# EAGLE design RetroTime (EAGLE 5.11)
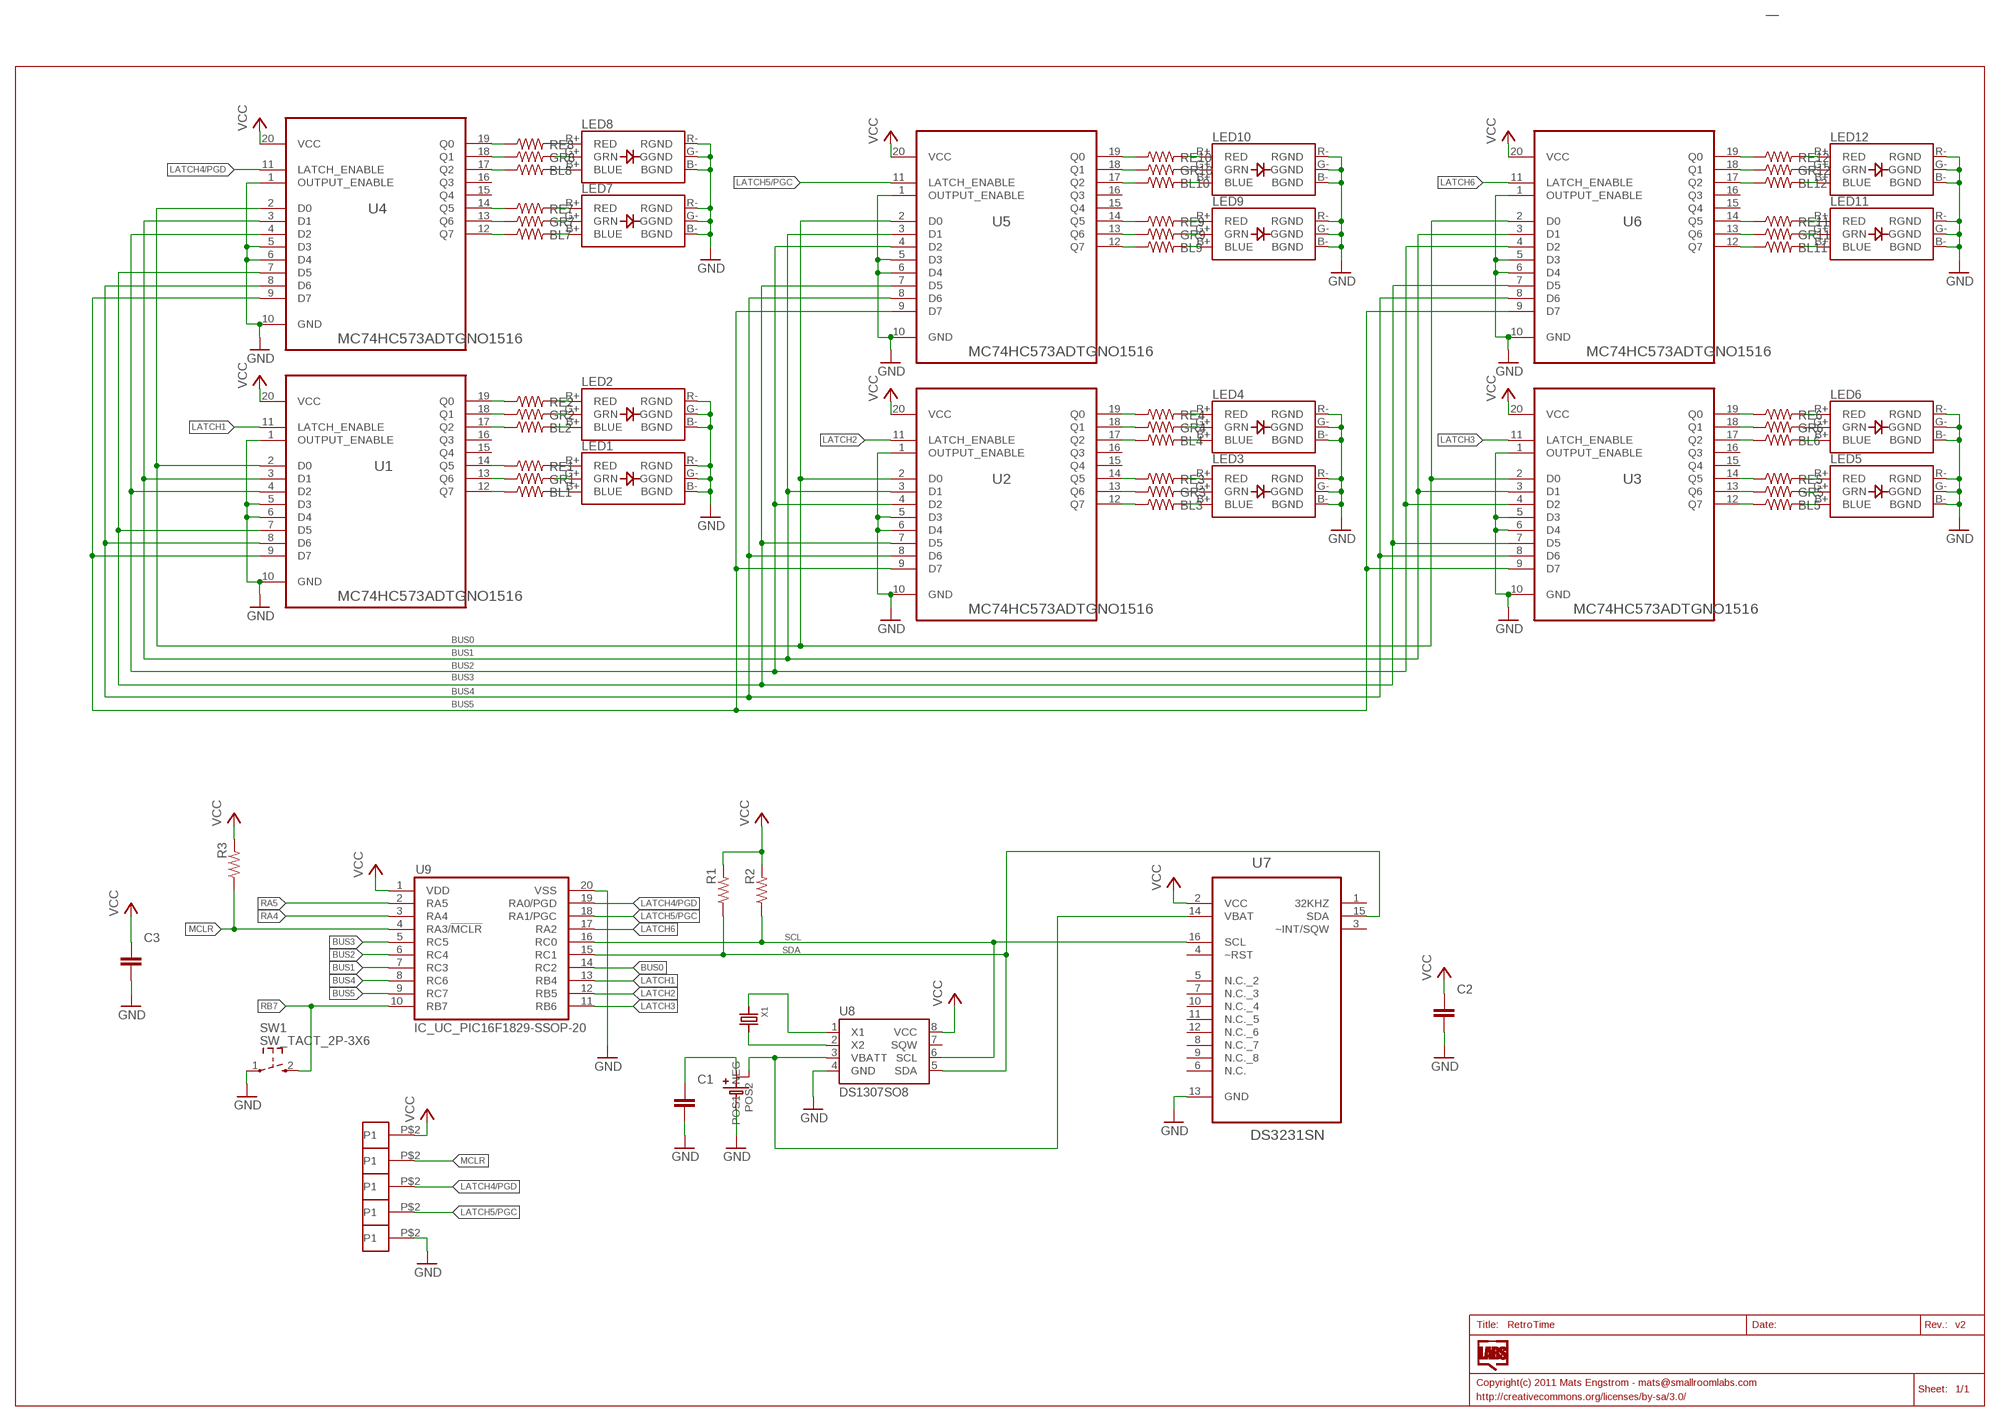
[diagram p0: schematic, sheet 1]

## Parts
BL1  RES0805A  [R0805A]
BL2  RES0805A  [R0805A]
BL3  RES0805A  [R0805A]
BL4  RES0805A  [R0805A]
BL5  RES0805A  [R0805A]
BL6  RES0805A  [R0805A]
BL7  RES0805A  [R0805A]
BL8  RES0805A  [R0805A]
BL9  RES0805A  [R0805A]
BL10  RES0805A  [R0805A]
BL11  RES0805A  [R0805A]
BL12  RES0805A  [R0805A]
C1  CAPACITOR_NPOL-0805  [C805]
C2  CAPACITOR_NPOL-0805  [C805]
C3  CAPACITOR_NPOL-0805  [C805]
GR1  RES0805A  [R0805A]
GR2  RES0805A  [R0805A]
GR3  RES0805A  [R0805A]
GR4  RES0805A  [R0805A]
GR5  RES0805A  [R0805A]
GR6  RES0805A  [R0805A]
GR7  RES0805A  [R0805A]
GR8  RES0805A  [R0805A]
GR9  RES0805A  [R0805A]
GR10  RES0805A  [R0805A]
GR11  RES0805A  [R0805A]
GR12  RES0805A  [R0805A]
LED1  LED-RGB-6PIN-PLCC6  [RGB-PLCC6]
LED2  LED-RGB-6PIN-PLCC6  [RGB-PLCC6]
LED3  LED-RGB-6PIN-PLCC6  [RGB-PLCC6]
LED4  LED-RGB-6PIN-PLCC6  [RGB-PLCC6]
LED5  LED-RGB-6PIN-PLCC6  [RGB-PLCC6]
LED6  LED-RGB-6PIN-PLCC6  [RGB-PLCC6]
LED7  LED-RGB-6PIN-PLCC6  [RGB-PLCC6]
LED8  LED-RGB-6PIN-PLCC6  [RGB-PLCC6]
LED9  LED-RGB-6PIN-PLCC6  [RGB-PLCC6]
LED10  LED-RGB-6PIN-PLCC6  [RGB-PLCC6]
LED11  LED-RGB-6PIN-PLCC6  [RGB-PLCC6]
LED12  LED-RGB-6PIN-PLCC6  [RGB-PLCC6]
P1  PAD-2X3  [PAD2X3]
P2  PAD-2X3  [PAD2X3]
P3  PAD-2X3  [PAD2X3]
P4  PAD-2X3  [PAD2X3]
P5  PAD-2X3  [PAD2X3]
R1  RES0805A  [R0805A]
R2  RES0805A  [R0805A]
R3  RES0805A  [R0805A]
RE1  RES0805A  [R0805A]
RE2  RES0805A  [R0805A]
RE3  RES0805A  [R0805A]
RE4  RES0805A  [R0805A]
RE5  RES0805A  [R0805A]
RE6  RES0805A  [R0805A]
RE7  RES0805A  [R0805A]
RE8  RES0805A  [R0805A]
RE9  RES0805A  [R0805A]
RE10  RES0805A  [R0805A]
RE11  RES0805A  [R0805A]
RE12  RES0805A  [R0805A]
SW1  SW_TACT_2P-3X6  [SW_TACT_3X6]
U1  MC74HC573ADTGNO1516  [SOP65P640X120-20N-NOPIN15/16]
U2  MC74HC573ADTGNO1516  [SOP65P640X120-20N-NOPIN15/16]
U3  MC74HC573ADTGNO1516  [SOP65P640X120-20N-NOPIN15/16]
U4  MC74HC573ADTGNO1516  [SOP65P640X120-20N-NOPIN15/16]
U5  MC74HC573ADTGNO1516  [SOP65P640X120-20N-NOPIN15/16]
U6  MC74HC573ADTGNO1516  [SOP65P640X120-20N-NOPIN15/16]
U7  DS3231SN  [SOIC127P1032X265-16N]
U8  DS1307SO8  [SO08]
U9  IC_UC_PIC16F1829-SSOP-20  [SSOP-20]
U$3  BATTERYCOIN-12MM-SMD  [CR1220-SMD]
X1  CRYSTAL32.768  [CRYSTAL32SMT]

## Nets
BUS0: U1.2(D0) U2.2(D0) U3.2(D0) U4.2(D0) U5.2(D0) U6.2(D0) U9.14(RC2)
BUS1: U1.3(D1) U2.3(D1) U3.3(D1) U4.3(D1) U5.3(D1) U6.3(D1) U9.7(RC3)
BUS2: U1.4(D2) U2.4(D2) U3.4(D2) U4.4(D2) U5.4(D2) U6.4(D2) U9.6(RC4)
BUS3: U1.7(D5) U2.7(D5) U3.7(D5) U4.7(D5) U5.7(D5) U6.7(D5) U9.5(RC5)
BUS4: U1.8(D6) U2.8(D6) U3.8(D6) U4.8(D6) U5.8(D6) U6.8(D6) U9.8(RC6)
BUS5: U1.9(D7) U2.9(D7) U3.9(D7) U4.9(D7) U5.9(D7) U6.9(D7) U9.9(RC7)
GND: C1.2 C2.2 C3.2 LED1.B-(BGND) LED1.G-(GGND) LED1.R-(RGND) LED2.B-(BGND) LED2.G-(GGND) LED2.R-(RGND) LED3.B-(BGND) LED3.G-(GGND) LED3.R-(RGND) LED4.B-(BGND) LED4.G-(GGND) LED4.R-(RGND) LED5.B-(BGND) LED5.G-(GGND) LED5.R-(RGND) LED6.B-(BGND) LED6.G-(GGND) LED6.R-(RGND) LED7.B-(BGND) LED7.G-(GGND) LED7.R-(RGND) LED8.B-(BGND) LED8.G-(GGND) LED8.R-(RGND) LED9.B-(BGND) LED9.G-(GGND) LED9.R-(RGND) LED10.B-(BGND) LED10.G-(GGND) LED10.R-(RGND) LED11.B-(BGND) LED11.G-(GGND) LED11.R-(RGND) LED12.B-(BGND) LED12.G-(GGND) LED12.R-(RGND) P5.P$2(P1) SW1.1 U1.1(OUTPUT_ENABLE) U1.5(D3) U1.6(D4) U1.10(GND) U2.1(OUTPUT_ENABLE) U2.5(D3) U2.6(D4) U2.10(GND) U3.1(OUTPUT_ENABLE) U3.5(D3) U3.6(D4) U3.10(GND) U4.1(OUTPUT_ENABLE) U4.5(D3) U4.6(D4) U4.10(GND) U5.1(OUTPUT_ENABLE) U5.5(D3) U5.6(D4) U5.10(GND) U6.1(OUTPUT_ENABLE) U6.5(D3) U6.6(D4) U6.10(GND) U7.13(GND) U8.4(GND) U9.20(VSS) U$3.-(NEG)
LATCH1: U1.11(LATCH_ENABLE) U9.13(RB4)
LATCH2: U2.11(LATCH_ENABLE) U9.12(RB5)
LATCH3: U3.11(LATCH_ENABLE) U9.11(RB6)
LATCH4/PGD: P3.P$2(P1) U4.11(LATCH_ENABLE) U9.19(RA0/PGD)
LATCH5/PGC: P4.P$2(P1) U5.11(LATCH_ENABLE) U9.18(RA1/PGC)
LATCH6: U6.11(LATCH_ENABLE) U9.17(RA2)
MCLR: P2.P$2(P1) R3.1 U9.4(RA3/!MCLR)
N$1: U8.2(X2) X1.2
N$2: U8.1(X1) X1.1
N$3: RE1.1 U1.14(Q5)
N$4: GR1.1 U1.13(Q6)
N$5: U7.14(VBAT) U8.3(VBATT) U$3.+$2(POS2)
N$6: BL1.1 U1.12(Q7)
N$7: RE2.1 U1.19(Q0)
N$8: GR2.1 U1.18(Q1)
N$9: BL2.1 U1.17(Q2)
N$10: LED2.R+(RED) RE2.2
N$11: GR2.2 LED2.G+(GRN)
N$12: BL2.2 LED2.B+(BLUE)
N$13: LED1.R+(RED) RE1.2
N$14: GR1.2 LED1.G+(GRN)
N$15: BL1.2 LED1.B+(BLUE)
N$16: LED4.R+(RED) RE4.2
N$17: RE3.1 U2.14(Q5)
N$18: GR3.1 U2.13(Q6)
N$19: BL3.1 U2.12(Q7)
N$20: RE4.1 U2.19(Q0)
N$21: GR4.1 U2.18(Q1)
N$22: BL4.1 U2.17(Q2)
N$23: GR4.2 LED4.G+(GRN)
N$24: BL4.2 LED4.B+(BLUE)
N$25: LED3.R+(RED) RE3.2
N$26: GR3.2 LED3.G+(GRN)
N$27: BL3.2 LED3.B+(BLUE)
N$28: RE5.1 U3.14(Q5)
N$29: GR5.1 U3.13(Q6)
N$30: BL5.1 U3.12(Q7)
N$31: RE6.1 U3.19(Q0)
N$32: GR6.1 U3.18(Q1)
N$33: BL6.1 U3.17(Q2)
N$34: LED5.R+(RED) RE5.2
N$35: GR5.2 LED5.G+(GRN)
N$36: BL5.2 LED5.B+(BLUE)
N$37: LED6.R+(RED) RE6.2
N$38: GR6.2 LED6.G+(GRN)
N$39: BL6.2 LED6.B+(BLUE)
N$40: LED7.R+(RED) RE7.2
N$41: GR7.2 LED7.G+(GRN)
N$42: BL7.2 LED7.B+(BLUE)
N$43: LED8.R+(RED) RE8.2
N$44: GR8.2 LED8.G+(GRN)
N$45: BL8.2 LED8.B+(BLUE)
N$46: RE7.1 U4.14(Q5)
N$47: GR7.1 U4.13(Q6)
N$48: BL7.1 U4.12(Q7)
N$49: RE8.1 U4.19(Q0)
N$50: GR8.1 U4.18(Q1)
N$51: BL8.1 U4.17(Q2)
N$52: LED9.R+(RED) RE9.2
N$53: GR9.2 LED9.G+(GRN)
N$54: BL9.2 LED9.B+(BLUE)
N$55: LED10.R+(RED) RE10.2
N$56: GR10.2 LED10.G+(GRN)
N$57: BL10.2 LED10.B+(BLUE)
N$58: RE9.1 U5.14(Q5)
N$59: GR9.1 U5.13(Q6)
N$60: BL9.1 U5.12(Q7)
N$61: RE10.1 U5.19(Q0)
N$62: GR10.1 U5.18(Q1)
N$63: BL10.1 U5.17(Q2)
N$64: RE11.1 U6.14(Q5)
N$65: GR11.1 U6.13(Q6)
N$66: BL11.1 U6.12(Q7)
N$67: RE12.1 U6.19(Q0)
N$68: GR12.1 U6.18(Q1)
N$69: BL12.1 U6.17(Q2)
N$70: LED12.R+(RED) RE12.2
N$71: GR12.2 LED12.G+(GRN)
N$72: BL12.2 LED12.B+(BLUE)
N$73: LED11.R+(RED) RE11.2
N$74: GR11.2 LED11.G+(GRN)
N$75: BL11.2 LED11.B+(BLUE)
N$76: C1.1 U$3.+$1(POS1)
RA4: U9.3(RA4)
RA5: U9.2(RA5)
RB7: SW1.2 U9.10(RB7)
SCL: R2.1 U7.16(SCL) U8.6(SCL) U9.16(RC0)
SDA: R1.1 U7.15(SDA) U8.5(SDA) U9.15(RC1)
VCC: C2.1 C3.1 P1.P$2(P1) R1.2 R2.2 R3.2 U1.20(VCC) U2.20(VCC) U3.20(VCC) U4.20(VCC) U5.20(VCC) U6.20(VCC) U7.2(VCC) U8.8(VCC) U9.1(VDD)
Unconnected: U1.15(Q4) U1.16(Q3) U2.15(Q4) U2.16(Q3) U3.15(Q4) U3.16(Q3) U4.15(Q4) U4.16(Q3) U5.15(Q4) U5.16(Q3) U6.15(Q4) U6.16(Q3) U7.1(32KHZ) U7.3(~INT/SQW) U7.4(~RST) U7.5(N.C._2) U7.6(N.C.) U7.7(N.C._3) U7.8(N.C._7) U7.9(N.C._8) U7.10(N.C._4) U7.11(N.C._5) U7.12(N.C._6) U8.7(SQW)

## Library data of the parts
BL1-BL12 GR1-GR12 R1-R3 RE1-RE12 = SmallRoomLabs:RES
C1-C3 = dp_devices:CAPACITOR_NPOL: Non-Polarized capacitor in various packages
LED1-LED12 = SmallRoomLabs:LED-RGB-6PIN
P1-P5 = SmallRoomLabs:PAD
SW1 = dp_devices:SW_TACT_2P
U1-U6 = SmallRoomLabs:MC74HC573ADTG: Octal Noninverting Latch
U7 = SmallRoomLabs:DS3231SN: Extremely Accurate I2C-Integrated RTC/TCXO/Crystal; MPN: DS3231SN#; OC_FARNELL: 1593292; OC_NEWARK: 68K3406; PACKAGE: SOIC-16; SUPPLIER: Maxim
U8 = SparkFun:DS1307
U9 = dp_devices:IC_UC_PIC16F1829
U$3 = SmallRoomLabs:BATTERY: A23 Farnell/E14 908721
X1 = microbuilder:CRYSTAL: Crystals HC49UP - Surface Mount Crystal 4.0MHz 18pF +/-30ppm Surface Mount Crystal [Digikey: 535-9857-1-ND] 12.0 MHz Surface Mount Crystal [Digikey: 535-9869-6-ND] 25.0 MHz Surface Mount Crystal [Digikey: 535-9078-1-ND] 3.2 x 2.5mm - MEMs SMT Crystal 12.0 MHz 8pF 15ppm 3.2 x 2.5mm Crystal [Digikey: 644-1047-1-ND] 16.0 MHz 8pF 15ppm 3.2 x 2.5mm Crystal [Digikey: 644-1049-1-ND] 16.0 MHz 10pF 10ppm 3.2 x 2.5mm Crystal [Digikey: 644-1100-1-ND] 27.12 MHz 18pF 30ppm 3.2 x 2.5mm Crystal [Digikey: 887-1424-1-ND] 4.9 x 1.8mm - MEMs SMT Crystal 32.768 KHz 12.5pF 20ppm 4.9 x 1.8mm Crystal [Digikey: SE2415CT-ND] Cylinder 32.768KHz Cylinder Crystal

## Board
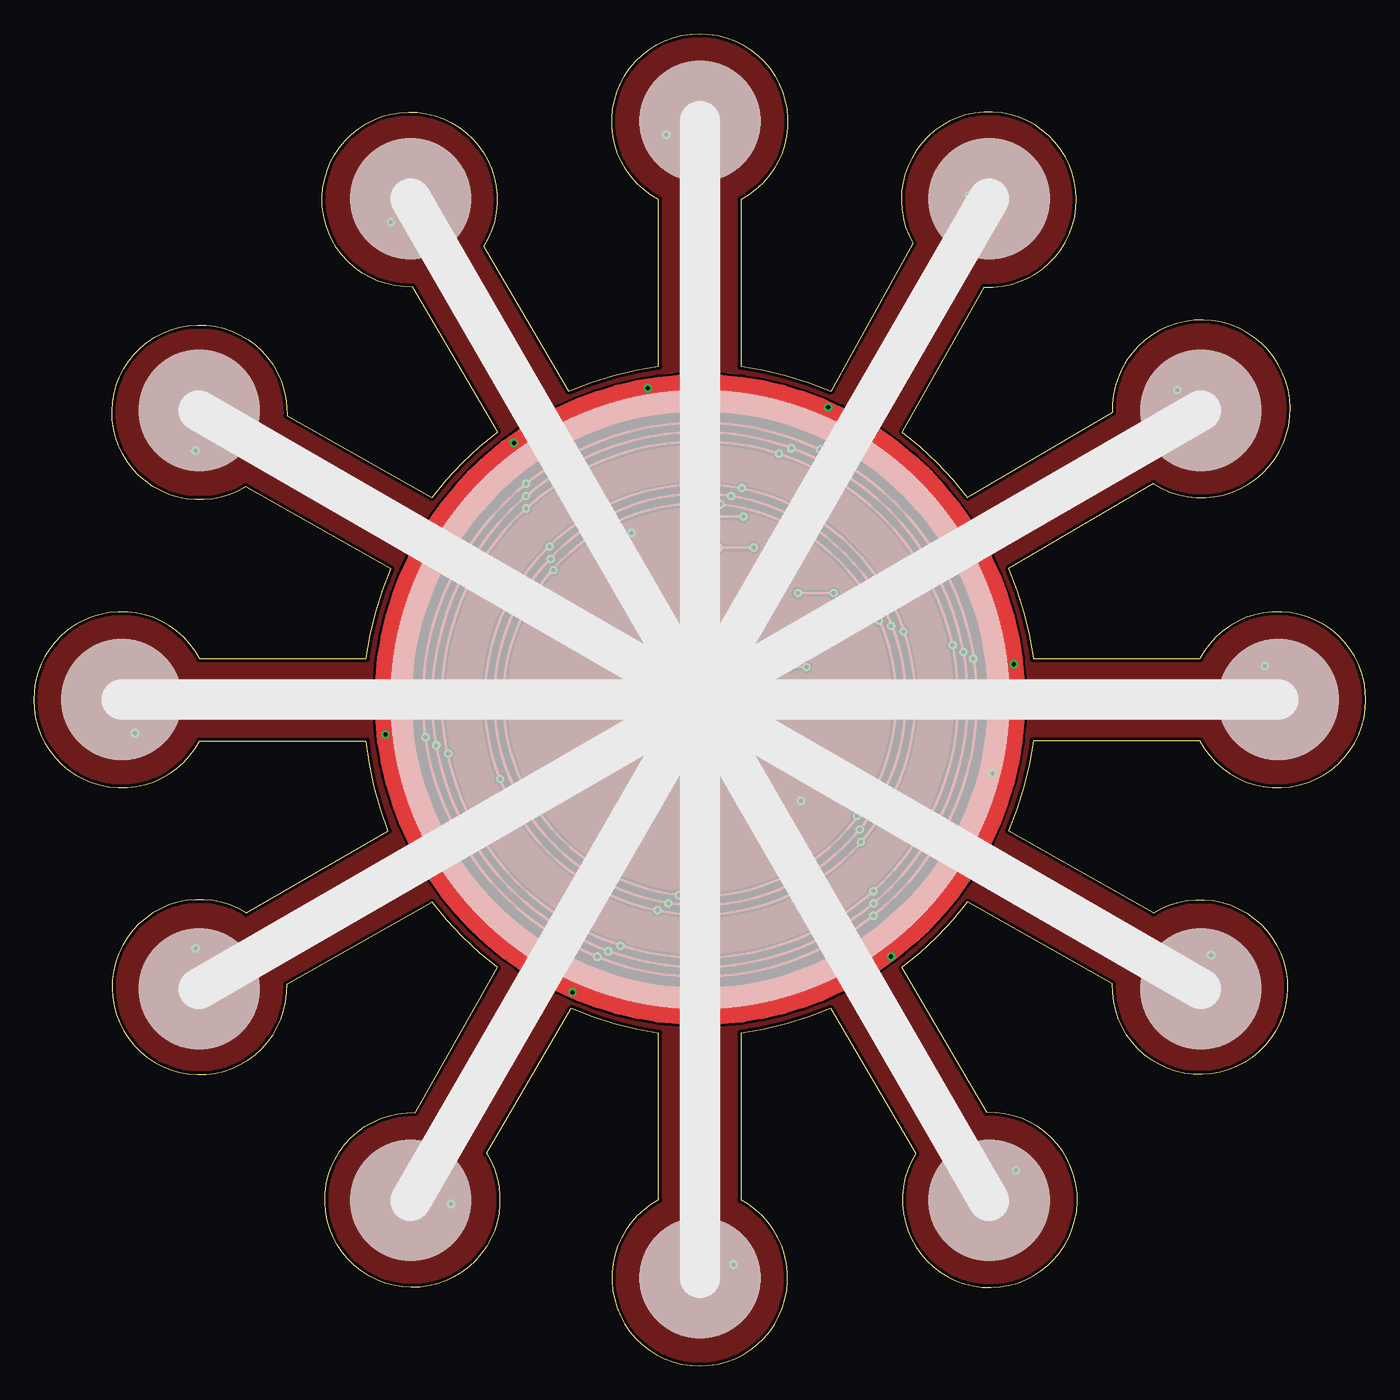
[diagram p1: board, top side]
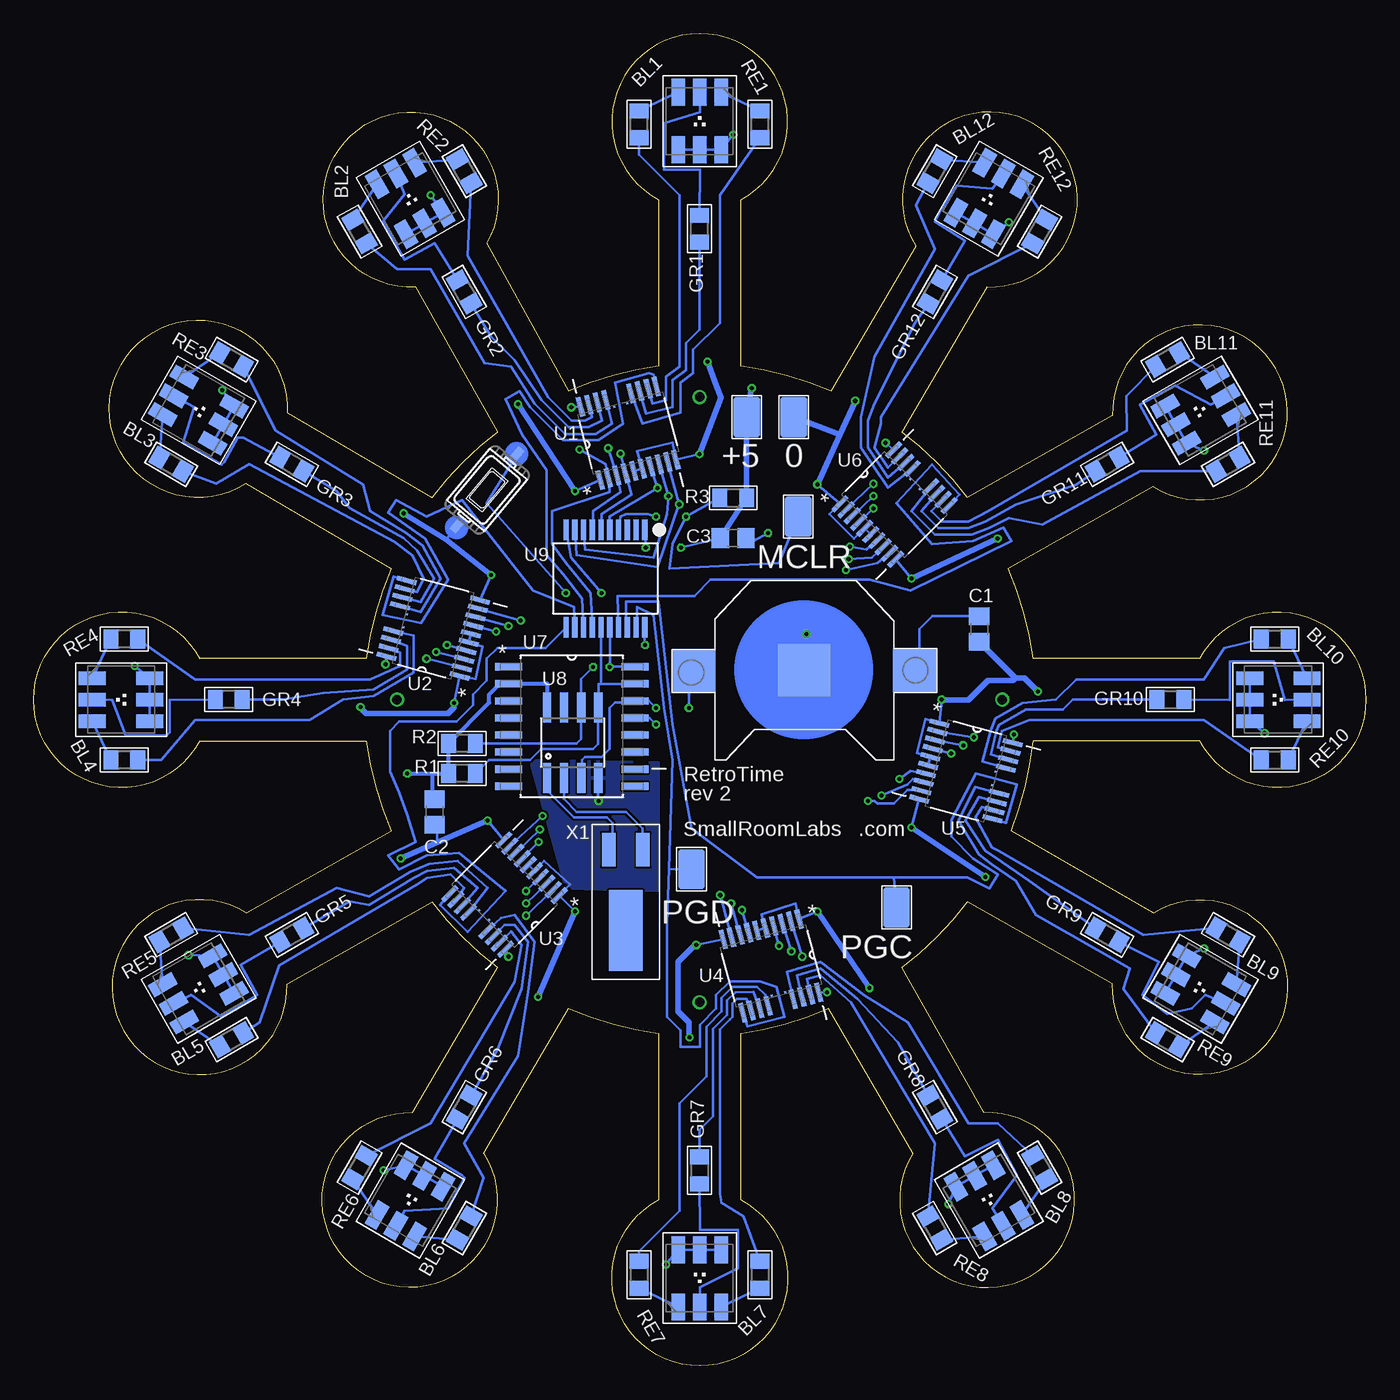
[diagram p2: board, bottom side, seen from below]

Size 99.04 x 99.04 mm. Coordinates in mm from the lower left corner, seen from the top.
Outline: 46.47,86.71 arc-304 52.57,86.71 52.57,74.31 arc-16 59.27,72.48 65.37,83.46 arc-303 70.65,80.2 64.56,69.43 arc-16 69.43,64.56 80.2,70.86 arc-305 83.25,65.57 72.48,59.27 arc-16 74.31,52.57 86.71,52.57 arc-304 86.71,46.47 74.31,46.47 arc-16 72.48,39.77 83.25,33.67 arc-304 80.2,28.39 69.43,34.48 arc-16 64.56,29.61 70.86,18.84 arc-304 65.57,15.79 59.27,26.56 arc-16 52.57,24.73 52.57,12.34 arc-304 46.47,12.34 46.47,24.73 arc-16 39.97,26.56 33.67,15.79 arc-304 28.39,18.84 34.48,29.61 arc-16 29.61,34.48 18.84,28.39 arc-304 15.79,33.67 26.36,39.77 arc-15 24.73,46.47 12.34,46.47 arc-304 12.34,52.57 24.73,52.57 arc-16 26.56,59.27 15.79,65.37 arc-304 18.84,70.65 29.61,64.56 arc-16 34.48,69.43 28.18,80.2 arc-304 33.47,83.25 39.77,72.48 arc-16 46.47,74.31 46.47,86.71
Copper layers (1*16): Top 0.035mm / dielectric 1.5mm / Bottom 0.035mm
Design rules "Fusion_eagle_rule_v1.1": minimum track width 6mil, minimum drill 12mil, track to track 6mil, track to pad 6mil, pad to pad 6mil, via to via 6mil, smd to smd 0mil, copper to edge 10mil, drill to drill 10mil, minimum pad ring 10mil, minimum via ring 6mil, stop-mask expansion 2mil, vias tented up to drill 100mil, thermal gap 10mil

### Footprints (pad centres in the part's own frame; a part is rotated, then mirrored left to right if it is on the bottom)
R0805A = smd 1.1 x 1.4: 1 -1,0; 2 1,0
C805 = smd 1.3 x 1.5: 1 -0.95,0; 2 0.95,0
RGB-PLCC6 = smd 1 x 2: B+ 1.6,-2.158; B- 1.6,2.108; G+ 0,-2.158; G- 0,2.108; R+ -1.6,-2.158; R- -1.6,2.108
PAD2X3 = smd 2 x 3: P$2 0,0
SW_TACT_3X6 = smd 1 x 0.6: 1 -3.5,0; 2 3.5,0
SOP65P640X120-20N-NOPIN15/16 = smd 1.473 x 0.356: 1 -2.819,2.921; 2 -2.819,2.286; 3 -2.819,1.626; 4 -2.819,0.965; 5 -2.819,0.33; 6 -2.819,-0.33; 7 -2.819,-0.965; 8 -2.819,-1.626; 9 -2.819,-2.286; 10 -2.819,-2.921; 11 2.819,-2.921; 12 2.819,-2.286; 13 2.819,-1.626; 14 2.819,-0.965; 17 2.819,0.965; 18 2.819,1.626; 19 2.819,2.286; 20 2.819,2.921 | smd 0.152 x 0.152: 15 2.159,-0.508; 16 2.159,0.508
SOIC127P1032X265-16N = smd 1.981 x 0.533: 1 -4.699,4.445; 2 -4.699,3.175; 3 -4.699,1.905; 4 -4.699,0.635; 5 -4.699,-0.635; 6 -4.699,-1.905; 7 -4.699,-3.175; 8 -4.699,-4.445; 9 4.699,-4.445; 10 4.699,-3.175; 11 4.699,-1.905; 12 4.699,-0.635; 13 4.699,0.635; 14 4.699,1.905; 15 4.699,3.175; 16 4.699,4.445
SO08 = smd 0.61 x 2.21: 1 -1.905,-2.616; 2 -0.635,-2.616; 3 0.635,-2.616; 4 1.905,-2.616; 5 1.905,2.616; 6 0.635,2.616; 7 -0.635,2.616; 8 -1.905,2.616
SSOP-20 = smd 0.4 x 1.5: 1 -2.925,-3.625; 2 -2.275,-3.625; 3 -1.625,-3.625; 4 -0.975,-3.625; 5 -0.325,-3.625; 6 0.325,-3.625; 7 0.975,-3.625; 8 1.625,-3.625; 9 2.275,-3.625; 10 2.925,-3.625; 11 2.925,3.625; 12 2.275,3.625; 13 1.625,3.625; 14 0.975,3.625; 15 0.325,3.625; 16 -0.325,3.625; 17 -0.975,3.625; 18 -1.625,3.625; 19 -2.275,3.625; 20 -2.925,3.625
CR1220-SMD = smd 3.2 x 3.2: +$1 -8.2,0; +$2 8.2,0 | smd 3.9 x 3.9: - 0,0
CRYSTAL32SMT = smd 2.5 x 1: 1 2.125,1.27; 2 2.125,-1.27 | smd 6 x 2.5: CYLINDER -3.875,0

### Placement (x,y rotation side)
BL1  54.03,92.3 90 bottom
BL2  74.81,84.32 120 bottom
BL3  88.82,67.02 150 bottom
BL4  92.3,45.04 180 bottom
BL5  84.32,24.26 210 bottom
BL6  67.02,10.25 240 bottom
BL7  45.04,6.77 270 bottom
BL8  24.26,14.75 300 bottom
BL9  10.25,32.04 330 bottom
BL10  6.77,54.03 0 bottom
BL11  14.75,74.81 30 bottom
BL12  32.04,88.82 60 bottom
C1  28.74,54.78 270 bottom
C2  69.23,41.19 270 bottom
C3  47.03,61.53 0 bottom
GR1  49.53,84.53 90 bottom
GR2  67.03,79.84 120 bottom
GR3  79.84,67.03 150 bottom
GR4  84.53,49.53 180 bottom
GR5  79.84,32.03 210 bottom
GR6  67.03,19.22 240 bottom
GR7  49.53,14.53 270 bottom
GR8  32.03,19.22 300 bottom
GR9  19.22,32.03 330 bottom
GR10  14.53,49.53 0 bottom
GR11  19.22,67.03 30 bottom
GR12  32.03,79.84 60 bottom
LED1  49.53,92.53 180 bottom
LED2  71.03,86.77 210 bottom
LED3  86.77,71.03 240 bottom
LED4  92.53,49.53 270 bottom
LED5  86.77,28.03 300 bottom
LED6  71.03,12.29 330 bottom
LED7  49.53,6.53 0 bottom
LED8  28.03,12.29 30 bottom
LED9  12.29,28.03 60 bottom
LED10  6.53,49.53 90 bottom
LED11  12.29,71.03 120 bottom
LED12  28.03,86.77 150 bottom
P1  46.03,70.53 0 bottom
P2  42.21,63.14 0 bottom
P3  50.13,36.92 0 bottom
P4  34.89,34.08 180 bottom
P5  42.53,70.53 0 bottom
R1  67.2,44.03 180 bottom
R2  67.2,46.27 180 bottom
R3  47.03,64.53 0 bottom
RE1  45.04,92.3 90 bottom
RE2  67.02,88.82 120 bottom
RE3  84.32,74.81 150 bottom
RE4  92.3,54.03 180 bottom
RE5  88.82,32.04 210 bottom
RE6  74.81,14.75 240 bottom
RE7  54.03,6.77 270 bottom
RE8  32.04,10.25 300 bottom
RE9  14.75,24.26 330 bottom
RE10  6.77,45.04 0 bottom
RE11  10.25,67.02 30 bottom
RE12  24.26,84.32 60 bottom
SW1  65.33,65.13 50 bottom
U1  54.84,69.34 105 bottom
U2  69.34,54.84 165 bottom
U3  64.03,35.04 225 bottom
U4  44.23,29.73 285 bottom
U5  29.73,44.23 345 bottom
U6  35.04,64.03 45 bottom
U7  59.03,47.53 0 bottom
U8  58.97,46.33 0 bottom
U9  56.53,58.53 180 bottom
U$3  41.75,51.71 180 bottom
X1  55.02,36.25 90 bottom

### Tracks (layer width: path | path; a pad name or v marks a point on that pad's centre or on a via)
BUS0  (via drill 0.3)
  Top 0.203: 69.9,52.58 69.96,52.22 70.09,50.88 70.13,49.53 70.09,48.19 69.96,46.84 69.74,45.51 69.43,44.2 69.04,42.91 68.57,41.65 68.01,40.42 67.37,39.23 66.66,38.09 65.88,36.99 65.02,35.95 64.1,34.97 63.12,34.05 62.46,33.51 | 69.9,52.58 69.74,53.55 69.43,54.87 69.04,56.16 68.57,57.42 68.01,58.64 67.37,59.83 66.66,60.98 65.88,62.07 65.02,63.12 64.1,64.1 63.12,65.02 62.07,65.88 60.98,66.66 59.83,67.37 58.64,68.01 57.42,68.57 57.17,68.66 | 57.17,68.66 56.16,69.04 54.87,69.43 53.55,69.74 52.22,69.96 50.88,70.09 49.53,70.13 48.19,70.09 46.84,69.96 45.51,69.74 44.2,69.43 42.91,69.04 41.65,68.57 40.42,68.01 39.23,67.37 38.09,66.66 36.99,65.88 36.64,65.58 | 36.64,65.58 35.95,65.02 34.97,64.1 34.05,63.12 33.19,62.07 32.41,60.98 31.69,59.83 31.06,58.64 30.5,57.42 30.03,56.16 29.64,54.87 29.33,53.55 29.11,52.22 28.98,50.88 28.93,49.53 28.98,48.19 29.11,46.84 29.13,46.72 | 29.13,46.72 29.33,45.51 29.64,44.2 30.03,42.91 30.5,41.65 31.06,40.42 31.69,39.23 32.41,38.09 33.19,36.99 34.05,35.95 34.97,34.97 35.95,34.05 36.99,33.19 38.09,32.41 39.23,31.69 40.42,31.06 41.65,30.5 41.8,30.45 | 41.8,30.45 42.91,30.03 44.2,29.64 45.51,29.33 46.84,29.11 48.19,28.98 49.53,28.93 50.88,28.98 52.22,29.11 53.55,29.33 54.87,29.64 56.16,30.03 57.42,30.5 58.64,31.06 59.83,31.69 60.98,32.41 62.07,33.19 62.46,33.51 | 29.13,46.72 v29.13,46.73 | 41.8,30.45 v41.9,30.42 | 62.46,33.51 v62.42,33.47 | 69.9,52.58 v69.84,52.57 | 57.17,68.66 v58.46,68.12 | 36.64,65.58 v36.62,65.57
  Bottom 0.203: v29.13,46.73 U5.2 | v41.9,30.42 U4.2 | v62.42,33.47 U3.2 | v69.84,52.57 U2.2 | v36.62,65.57 U6.2 | U9.14 57.65,57.45 59.48,59.68 60.49,61.1 60.49,63.54 56.23,64.96 U1.2 56.53,67.03 v58.46,68.12
BUS1  (via drill 0.3)
  Top 0.203: 69.11,53.09 69.26,52.13 69.39,50.84 69.43,49.53 69.39,48.23 69.26,46.94 69.05,45.65 68.76,44.38 68.38,43.14 67.92,41.92 67.38,40.73 66.77,39.58 66.08,38.48 65.32,37.42 64.5,36.41 63.6,35.46 62.65,34.57 62.52,34.46 | 69.11,53.09 69.05,53.42 68.76,54.68 68.38,55.93 67.92,57.15 67.38,58.34 66.77,59.48 66.08,60.59 65.32,61.65 64.5,62.65 63.6,63.6 62.65,64.5 61.65,65.32 60.59,66.08 59.48,66.77 58.34,67.38 57.15,67.92 56.34,68.22 | 56.34,68.22 55.93,68.38 54.68,68.76 53.42,69.05 52.13,69.26 50.84,69.39 49.53,69.43 48.23,69.39 46.94,69.26 45.65,69.05 44.38,68.76 43.14,68.38 41.92,67.92 40.73,67.38 39.58,66.77 38.48,66.08 37.42,65.32 36.63,64.68 | 36.63,64.68 36.41,64.5 35.46,63.6 34.57,62.65 33.75,61.65 32.99,60.59 32.3,59.48 31.69,58.34 31.15,57.15 30.69,55.93 30.31,54.68 30.02,53.42 29.8,52.13 29.68,50.84 29.63,49.53 29.68,48.23 29.8,46.94 29.93,46.15 | 29.93,46.15 30.02,45.65 30.31,44.38 30.69,43.14 31.15,41.92 31.69,40.73 32.3,39.58 32.99,38.48 33.75,37.42 34.57,36.41 35.46,35.46 36.41,34.57 37.42,33.75 38.48,32.99 39.58,32.3 40.73,31.69 41.92,31.15 42.8,30.82 | 42.8,30.82 43.14,30.69 44.38,30.31 45.65,30.02 46.94,29.8 48.23,29.68 49.53,29.63 50.84,29.68 52.13,29.8 53.42,30.02 54.68,30.31 55.93,30.69 57.15,31.15 58.34,31.69 59.48,32.3 60.59,32.99 61.65,33.75 62.52,34.46 | 29.93,46.15 v29.93,46.13 | 42.8,30.82 v42.71,30.83 | 62.52,34.46 v62.42,34.38 | 69.11,53.09 v69.13,53.08 | 56.34,68.22 v56.33,68.22 | 36.63,64.68 v36.62,64.66
  Bottom 0.203: v29.93,46.13 U5.3 | v42.71,30.83 U4.3 | v62.42,34.38 U3.3 | v69.13,53.08 U2.3 | v56.33,68.22 U1.3 55.41,64.96 57.45,63.54 U9.7 | v36.62,64.66 U6.3
BUS2  (via drill 0.3)
  Top 0.203: 68.3,53.56 68.36,53.28 68.57,52.04 68.69,50.79 68.73,49.53 68.69,48.28 68.57,47.03 68.36,45.79 68.08,44.56 67.71,43.36 67.27,42.19 66.75,41.04 66.16,39.93 65.5,38.87 64.77,37.85 63.97,36.87 63.11,35.96 62.48,35.37 | 68.3,53.56 68.08,54.5 67.71,55.71 67.27,56.88 66.75,58.03 66.16,59.13 65.5,60.2 64.77,61.22 63.97,62.19 63.11,63.11 62.19,63.97 61.22,64.77 60.2,65.5 59.13,66.16 58.03,66.75 56.88,67.27 55.71,67.71 55.46,67.79 | 55.46,67.79 54.5,68.08 53.28,68.36 52.04,68.57 50.79,68.69 49.53,68.73 48.28,68.69 47.03,68.57 45.79,68.36 44.56,68.08 43.36,67.71 42.19,67.27 41.04,66.75 39.93,66.16 38.87,65.5 37.85,64.77 36.87,63.97 36.67,63.77 | 36.67,63.77 35.96,63.11 35.1,62.19 34.3,61.22 33.57,60.2 32.91,59.13 32.31,58.03 31.8,56.88 31.35,55.71 30.99,54.5 30.7,53.28 30.5,52.04 30.37,50.79 30.33,49.53 30.37,48.28 30.5,47.03 30.7,45.79 30.76,45.56 | 30.76,45.56 30.99,44.56 31.35,43.36 31.8,42.19 32.31,41.04 32.91,39.93 33.57,38.87 34.3,37.85 35.1,36.87 35.96,35.96 36.87,35.1 37.85,34.3 38.87,33.57 39.93,32.91 41.04,32.31 42.19,31.8 43.36,31.35 43.59,31.28 | 43.59,31.28 44.56,30.99 45.79,30.7 47.03,30.5 48.28,30.37 49.53,30.33 50.79,30.37 52.04,30.5 53.28,30.7 54.5,30.99 55.71,31.35 56.88,31.8 58.03,32.31 59.13,32.91 60.2,33.57 61.22,34.3 62.19,35.1 62.48,35.37 | 30.76,45.56 v30.83,45.53 | 43.59,31.28 v43.63,31.23 | 62.48,35.37 v62.42,35.3 | 68.3,53.56 v68.32,53.58 | 55.46,67.79 v55.41,67.81 | 36.67,63.77 v36.62,63.74
  Bottom 0.203: v30.83,45.53 U5.4 | v43.63,31.23 U4.4 | v62.42,35.3 U3.4 | v68.32,53.58 U2.4 | v55.41,67.81 U1.4 54.6,64.76 56.84,63.34 U9.6 | v36.62,63.74 U6.4
BUS3  (via drill 0.3)
  Top 0.203: 64.68,54.68 64.99,53.67 65.23,52.65 65.4,51.62 65.5,50.58 65.53,49.53 65.5,48.49 65.4,47.45 65.23,46.41 64.99,45.39 64.68,44.39 64.32,43.41 63.88,42.46 63.39,41.53 62.84,40.64 62.23,39.79 61.56,38.98 | 64.68,54.68 64.32,55.66 63.88,56.61 63.39,57.53 62.84,58.42 62.23,59.27 61.56,60.08 60.85,60.85 60.08,61.56 59.27,62.23 58.42,62.84 57.53,63.39 56.61,63.88 55.66,64.32 54.68,64.68 53.67,64.99 52.65,65.23 | 52.65,65.23 51.62,65.4 50.58,65.5 49.53,65.53 48.49,65.5 47.45,65.4 46.41,65.23 45.39,64.99 44.39,64.68 43.41,64.32 42.46,63.88 41.53,63.39 40.64,62.84 39.79,62.23 38.98,61.56 38.22,60.85 37.61,60.19 | 37.61,60.19 37.5,60.08 36.84,59.27 36.23,58.42 35.68,57.53 35.18,56.61 34.75,55.66 34.38,54.68 34.08,53.67 33.84,52.65 33.67,51.62 33.57,50.58 33.53,49.53 33.57,48.49 33.67,47.45 33.84,46.41 34.08,45.39 34.35,44.48 | 34.35,44.48 34.38,44.39 34.75,43.41 35.18,42.46 35.68,41.53 36.23,40.64 36.84,39.79 37.5,38.98 38.22,38.22 38.98,37.5 39.79,36.84 40.64,36.23 41.53,35.68 42.46,35.18 43.41,34.75 44.39,34.38 45.39,34.08 46.41,33.84 | 46.41,33.84 47.45,33.67 48.49,33.57 49.53,33.53 50.58,33.57 51.62,33.67 52.65,33.84 53.67,34.08 54.68,34.38 55.66,34.75 56.61,35.18 57.53,35.68 58.42,36.23 59.27,36.84 60.08,37.5 60.85,38.22 61.56,38.98 | 34.35,44.48 v34.69,43.63 | 37.61,60.19 v38.34,60.9 | 52.65,65.23 v52.67,65.27 | 64.68,54.68 v64.66,54.6 | 61.56,38.98 v61.51,38.95 | 46.41,33.84 v46.37,33.87
  Bottom 0.203: U1.7 v52.67,65.27 56.23,63.14 U9.5 | v64.66,54.6 U2.7 | v61.51,38.95 U3.7 | v46.37,33.87 U4.7 | U6.7 37.13,60.7 v38.34,60.9 | U5.7 33.87,44.24 v34.69,43.63
BUS4  (via drill 0.3)
  Top 0.203: 63.81,55.02 64.02,54.45 64.31,53.49 64.54,52.52 64.7,51.53 64.8,50.53 64.83,49.53 64.8,48.53 64.7,47.54 64.54,46.55 64.31,45.57 64.02,44.62 63.67,43.68 63.26,42.77 62.78,41.88 62.25,41.03 61.67,40.22 61.38,39.86 | 63.81,55.02 63.67,55.39 63.26,56.3 62.78,57.18 62.25,58.03 61.67,58.85 61.04,59.62 60.35,60.35 59.62,61.04 58.85,61.67 58.03,62.25 57.18,62.78 56.3,63.26 55.39,63.67 54.45,64.02 53.49,64.31 52.52,64.54 51.74,64.67 | 51.74,64.67 51.53,64.7 50.53,64.8 49.53,64.83 48.53,64.8 47.54,64.7 46.55,64.54 45.57,64.31 44.62,64.02 43.68,63.67 42.77,63.26 41.88,62.78 41.03,62.25 40.22,61.67 39.45,61.04 38.71,60.35 38.03,59.62 37.66,59.18 | 37.66,59.18 37.4,58.85 36.81,58.03 36.28,57.18 35.81,56.3 35.4,55.39 35.05,54.45 34.75,53.49 34.53,52.52 34.36,51.53 34.27,50.53 34.23,49.53 34.27,48.53 34.36,47.54 34.53,46.55 34.75,45.57 35.05,44.62 35.26,44.03 | 35.26,44.03 35.4,43.68 35.81,42.77 36.28,41.88 36.81,41.03 37.4,40.22 38.03,39.45 38.71,38.71 39.45,38.03 40.22,37.4 41.03,36.81 41.88,36.28 42.77,35.81 43.68,35.4 44.62,35.05 45.57,34.75 46.55,34.53 47.31,34.4 | 47.31,34.4 47.54,34.36 48.53,34.27 49.53,34.23 50.53,34.27 51.53,34.36 52.52,34.53 53.49,34.75 54.45,35.05 55.39,35.4 56.3,35.81 57.18,36.28 58.03,36.81 58.85,37.4 59.62,38.03 60.35,38.71 61.04,39.45 61.38,39.86 | 35.26,44.03 v36.01,42.41 | 37.66,59.18 v38.45,59.99 | 51.74,64.67 v51.86,64.66 | 63.81,55.02 v63.74,55.01 | 61.38,39.86 v61.41,39.87 | v47.18,34.38 47.31,34.4
  Bottom 0.203: U1.8 v51.86,64.66 51.96,63.34 52.98,60.09 58.06,60.7 U9.8 | v63.74,55.01 U2.8 | v61.41,39.87 U3.8 | U4.8 v47.18,34.38 | U6.8 36.72,60.09 v38.45,59.99 | U5.8 33.67,43.63 34.08,43.22 v36.01,42.41
BUS5  (via drill 0.3)
  Top 0.203: 62.89,55.42 63.02,55.12 63.36,54.23 63.64,53.31 63.85,52.38 64.01,51.44 64.1,50.49 64.13,49.53 64.1,48.58 64.01,47.63 63.85,46.69 63.64,45.75 63.36,44.84 63.02,43.95 62.63,43.08 62.18,42.23 61.67,41.42 61.17,40.72 | 62.89,55.42 62.63,55.99 62.18,56.83 61.67,57.64 61.12,58.42 60.51,59.16 59.86,59.86 59.16,60.51 58.42,61.12 57.64,61.67 56.83,62.18 55.99,62.63 55.12,63.02 54.23,63.36 53.31,63.64 52.38,63.85 51.44,64.01 50.99,64.05 | 50.99,64.05 50.49,64.1 49.53,64.13 48.58,64.1 47.63,64.01 46.69,63.85 45.75,63.64 44.84,63.36 43.95,63.02 43.08,62.63 42.23,62.18 41.42,61.67 40.65,61.12 39.91,60.51 39.21,59.86 38.56,59.16 37.95,58.42 37.78,58.18 | 37.78,58.18 37.39,57.64 36.89,56.83 36.44,55.99 36.04,55.12 35.71,54.23 35.43,53.31 35.21,52.38 35.06,51.44 34.96,50.49 34.93,49.53 34.96,48.58 35.06,47.63 35.21,46.69 35.43,45.75 35.71,44.84 36.04,43.95 36.2,43.6 | 36.2,43.6 36.44,43.08 36.89,42.23 37.39,41.42 37.95,40.65 38.56,39.91 39.21,39.21 39.91,38.56 40.65,37.95 41.42,37.39 42.23,36.89 43.08,36.44 43.95,36.04 44.84,35.71 45.75,35.43 46.69,35.21 47.63,35.06 48.14,35.01 | 48.14,35.01 48.58,34.96 49.53,34.93 50.49,34.96 51.44,35.06 52.38,35.21 53.31,35.43 54.23,35.71 55.12,36.04 55.99,36.44 56.83,36.89 57.64,37.39 58.42,37.95 59.16,38.56 59.86,39.21 60.51,39.91 61.12,40.65 61.17,40.72 | 36.2,43.6 v37.02,42 | 37.78,58.18 v38.65,59.17 | 50.99,64.05 v51.04,64.05 | 62.89,55.42 v62.83,55.41 | 61.17,40.72 v61.2,40.88 | v48,34.99 48.14,35.01
  Bottom 0.203: U1.9 v51.04,64.05 52.66,59.38 58.66,60.29 U9.9 | v62.83,55.41 U2.9 | v61.2,40.88 U3.9 | U4.9 v48,34.99 | U6.9 36.31,59.68 v38.65,59.17 | v37.02,42 36.52,42 36.31,41.8 35.09,41.8 34.08,42.82 33.06,42.82 U5.9
GND  (via drill 0.3)
  Bottom 0.203: U1.5 U1.6 54.19,68.01 51.55,68.62 U1.10 v49.53,67.78 | U2.6 U2.5 65.68,53.48 66.18,51.04 U2.1 v67.78,49.28 | U3.6 U3.5 61.1,37.53 59.17,35.8 U3.1 v58.78,33.78 | U4.6 U4.5 44.95,33.57 42.41,34.38 U4.1 v40.78,33.78 | U5.6 U5.5 33.37,45.56 32.76,48.1 U5.1 v31.53,49.53 | U6.6 U6.5 38.04,61.51 39.87,63.34 U6.1 v40.78,65.53 | v33.78,58.53 U6.10 | U1.1 v58.78,65.03 | U2.10 v65.03,58.78 | U3.10 v65.28,40.53 | v49.78,31.28 U4.10 | v33.78,40.03 U5.10 | U$3.- 41.75,54.55 v41.6,54.4 | U8.4 57.06,42.03 v57.04,42 | 53.61,55.03 53.61,54.02 v53.58,53.58 | C2.2 69.03,40.24 69.03,38.9 | C3.2 45.52,61.31 v44.44,61.92 | LED12.B- LED12.G- LED12.R- v26.53,85.03 | LED1.B- LED1.G- LED1.R- v47.03,91.53 | LED2.B- LED2.G- LED2.R- v69.53,87.03 | LED3.B- LED3.G- LED3.R- v85.03,72.53 | LED4.B- LED4.G- LED4.R- v91.53,52.03 | LED5.B- LED5.G- LED5.R- v87.53,30.53 | LED7.B- LED7.G- LED7.R- v52.03,7.53 | LED6.B- LED6.G- LED6.R- v73.03,14.53 | LED8.B- LED8.G- LED8.R- v31.03,12.03 | LED9.R- LED9.G- LED9.B- v12.03,31.03 | LED10.B- LED10.G- LED10.R- v7.53,47.03 | LED11.B- LED11.G- LED11.R- v12.03,68.03 | 68.36,61.42 SW1.1 | v52.77,47.69 53.25,48.17 U7.13
  Bottom 0.305: U9.20 53.61,55.03
  Bottom 0.406: v27.38,61.5 v33.78,58.53 | v40.78,65.53 39.1,69.23 | 39.1,69.23 v37.96,71.74 | v58.78,65.03 v63.03,71.49 | v65.03,58.78 68.36,61.42 v71.54,63.38 | v65.28,40.53 69.03,38.9 v71.75,37.72 | v36.9,28.09 v40.78,33.78 | v28.29,36.35 v33.78,40.03 | v61.55,27.42 v58.78,33.78 | v48.95,74.64 48.27,72.83 47.96,71.99 v49.53,67.78 | v24.38,50.14 25.38,51.15 26.06,51.15 | v49.78,31.28 49.88,31.28 51.15,30.01 51.15,26.36 50.33,25.54 50.33,24.53 | v67.78,49.28 67.78,48.94 68.22,48.5 74.31,48.5 74.72,48.91 | 39.1,69.23 P5.P$2 | 26.06,51.15 C1.2 | 31.44,49.52 29.56,49.52 28.11,50.97 26.24,50.97 26.06,51.15
  other vias: 74.75,48.98 50.29,24.42
  pour Top: -0.47,-0.47 -0.47,99.53 99.53,99.53 99.53,-0.47
  pour Top: 33.27,49.52 33.27,36.11 33.27,34.69 65.57,34.69 65.57,63.75 33.27,63.75
  pour Bottom: 52.57,44.85 62.12,45.05 59.48,35.5 52.57,35.3
LATCH1
  Bottom 0.203: U1.11 52.98,73.7 53.28,73.8 55.82,73.09 55.21,70.04 57.04,68.82 59.68,68.82 62.12,71.26 62.93,72.48 63.95,71.87 62.73,69.23 60.9,66.59 60.9,60.29 59.68,58.87 58.26,57.04 U9.13
LATCH2
  Bottom 0.203: U2.11 72.28,58.66 73.09,55.82 70.25,55.21 68.22,58.46 69.94,61.51 72.69,63.44 72.08,64.35 69.84,63.14 67.2,64.35 61.92,57.65 58.87,56.43 U9.12
LATCH3
  Bottom 0.203: U3.11 68.82,34.28 66.79,32.25 63.95,35.3 67.4,38.14 69.84,37.94 71.87,36.92 72.69,37.94 70.65,38.95 71.26,40.99 71.87,42.61 72.56,44.21 72.56,47.21 71.87,47.9 67.61,47.9 66.39,49.11 66.39,49.93 65.37,50.94 65.37,52.57 64.56,53.38 60.99,53.38 U9.11
LATCH4/PGD
  Bottom 0.203: U4.11 45.96,25.24 43.22,25.95 43.83,28.18 45.05,28.59 47.29,28.59 48.3,27.58 48.3,26.56 49.52,25.34 49.52,23.71 50.94,23.71 50.94,24.93 51.96,25.95 51.96,32.86 51.82,36.94 | U9.19 54.19,54.97 54.19,56.43 52.98,55.82 52.16,48.91 51.55,45.05 51.82,36.94 | 51.82,36.94 P3.P$2
LATCH5/PGC
  Bottom 0.203: U5.11 26.76,40.38 25.95,43.22 29,44.03 30.83,40.58 30.83,39.36 29.2,37.74 27.37,36.52 27.98,35.5 29.61,36.31 35.09,36.31 | U9.18 55.01,55.01 55.01,56.84 52.57,56.84 51.55,47.69 50.13,39.97 45.25,36.31 35.09,36.31 | 35.09,36.31 P4.P$2
LATCH6
  Bottom 0.203: U6.11 30.22,64.76 32.25,67 34.89,64.15 32.25,61.1 29.2,61.31 26.97,62.32 26.36,61.31 33.87,57.65 36.92,58.46 48.71,58.46 49.93,57.24 55.62,57.24 U9.17
MCLR  (via drill 0.3)
  Top 0.203: v50.54,63.14 v52.77,63.14
  Bottom 0.203: U9.4 55.41,63.14 55.01,63.34 53.38,63.34 v52.77,63.14 | R3.1 v50.54,63.14 51.55,61.1 51.76,59.27 43.63,59.68 P2.P$2
N$1
  Bottom 0.203: X1.2 53.79,38.41 53.79,39.97 55.01,41.19 58.66,41.19 59.6,42.13 U8.2
N$2
  Bottom 0.203: X1.1 56.02,38.64 56.02,40.38 56.43,40.78 58.87,40.78 60.87,42.79 U8.1
N$3
  Bottom 0.203: U1.14 53.78,70.03 50.94,70.86 50.94,73.09 50.03,73.8 50.03,75.53 48.03,77.53 48.03,87.03 RE1.1
N$4
  Bottom 0.203: U1.13 53.53,70.78 51.53,71.28 51.53,73.28 50.53,74.03 50.53,76.03 49.53,77.03 GR1.1
N$5  (via drill 0.3)
  Top 0.203: v50.33,48.91 v52.77,48.91
  Bottom 0.203: U8.3 58.26,43.79 58.26,45.05 58.06,45.25 56.84,45.25 56.23,45.86 56.23,48.91 55.82,49.32 54.46,49.32 U7.14 53.3,49.44 v52.77,48.91 | v50.33,48.91 50.33,51.32 U$3.+$2
N$6
  Bottom 0.203: U1.12 53.03,71.53 52.03,71.78 52.03,73.53 51.03,74.28 51.03,87.03 54.03,90.03 BL1.1
N$7
  Bottom 0.203: U1.19 57.53,70.53 58.03,70.28 59.03,70.28 60.78,72.03 66.78,82.53 RE2.1
N$8
  Bottom 0.203: U1.18 56.78,70.28 57.78,69.78 59.28,69.78 61.28,71.78 63.28,74.78 65.03,76.53 GR2.1
N$9
  Bottom 0.203: U1.17 56.03,70.03 57.28,69.28 59.53,69.28 61.78,71.53 63.53,74.28 65.53,74.53 69.53,81.53 72.03,81.53 BL2.1
N$10
  Bottom 0.203: RE2.2 LED2.R+
N$11
  Bottom 0.203: GR2.2 69.23,83.46 71.47,82.24 73.09,85.08 71.47,87.11 LED2.G+
N$12
  Bottom 0.203: BL2.2 LED2.B+
N$13
  Bottom 0.203: RE1.2 LED1.R+
N$14
  Bottom 0.203: GR1.2 49.52,88.94 52.16,88.94 52.16,92.4 49.52,93.21 LED1.G+
N$15
  Bottom 0.203: LED1.B+ BL1.2
N$16
  Bottom 0.203: LED4.R+ RE4.2
N$17
  Bottom 0.203: U2.14 70.28,56.03 68.78,58.53 70.14,60.98 71.39,61.93 74.03,63.53 74.53,65.53 81.03,69.53 RE3.1
N$18
  Bottom 0.203: U2.13 70.28,56.78 69.28,58.53 70.53,60.63 71.53,61.53 75.53,63.78 76.53,65.03 GR3.1
N$19
  Bottom 0.203: U2.12 70.53,57.53 70.03,58.53 70.89,60.23 72.26,61.29 83.03,67.03 85.49,65.57 BL3.1
N$20
  Bottom 0.203: U2.19 71.78,53.03 71.78,52.03 74.03,51.03 87.03,51.03 RE4.1
N$21
  Bottom 0.203: U2.18 71.28,53.53 71.28,51.78 73.78,50.28 77.53,50.03 80.53,49.53 GR4.1
N$22
  Bottom 0.203: U2.17 70.78,54.28 70.78,51.53 73.78,49.78 76.03,49.53 78.53,48.03 87.03,48.03 89.55,45.05 BL4.1
N$23
  Bottom 0.203: GR4.2 88.94,49.52 88.94,47.08 89.14,46.88 92.19,46.88 93.21,49.52 LED4.G+
N$24
  Bottom 0.203: BL4.2 LED4.B+
N$25
  Bottom 0.203: RE3.2 LED3.R+
N$26
  Bottom 0.203: GR3.2 83.46,69.03 83.86,69.03 84.88,67.2 85.08,67 87.93,68.62 87.11,71.26 LED3.G+
N$27
  Bottom 0.203: BL3.2 LED3.B+
N$28
  Bottom 0.203: U3.14 65.28,35.53 67.53,37.53 69.64,37.33 71.06,36.72 74.11,34.89 76.53,35.53 83.03,32.03 RE5.1
N$29
  Bottom 0.203: U3.13 66.03,35.53 67.78,37.03 69.78,36.78 70.78,36.28 74.11,34.28 75.53,34.53 GR5.1
N$30
  Bottom 0.203: U3.12 67.03,35.53 68.03,36.53 69.78,36.28 70.53,35.78 80.78,29.78 82.24,25.54 BL5.1
N$31
  Bottom 0.203: U3.19 63.53,32.28 62.78,31.28 63.28,28.53 69.53,18.03 RE6.1
N$32
  Bottom 0.203: U3.18 64.03,32.78 63.28,32.78 62.28,31.53 62.78,28.03 64.53,23.53 GR6.1
N$33
  Bottom 0.203: U3.17 64.28,33.28 63.28,33.53 61.78,31.53 62.28,27.78 63.03,23.03 67.03,16.53 65.57,13.96 BL6.1
N$34
  Bottom 0.203: LED5.R+ RE5.2
N$35
  Bottom 0.203: GR5.2 83.66,29.81 82.44,27.58 85.08,25.95 87.32,27.58 LED5.G+
N$36
  Bottom 0.203: BL5.2 LED5.B+
N$37
  Bottom 0.203: LED6.R+ RE6.2
N$38
  Bottom 0.203: GR6.2 69.23,15.38 67.2,14.16 67,13.96 68.22,11.73 71.47,11.52 LED6.G+
N$39
  Bottom 0.203: BL6.2 LED6.B+
N$40
  Bottom 0.203: LED7.R+ RE7.2
N$41
  Bottom 0.203: GR7.2 49.52,10.1 46.68,10.1 46.68,7.26 49.52,5.83 LED7.G+
N$42
  Bottom 0.203: BL7.2 LED7.B+
N$43
  Bottom 0.203: LED8.R+ RE8.2
N$44
  Bottom 0.203: GR8.2 29.81,15.59 27.37,16.81 25.95,14.16 27.78,11.73 LED8.G+
N$45
  Bottom 0.203: LED8.B+ BL8.2
N$46
  Bottom 0.203: U4.14 44.64,27.58 45.25,28.18 47.08,28.18 47.9,27.37 47.9,26.36 49.03,25.22 49.03,21.53 51.03,19.53 51.03,11.53 54.03,8.53 RE7.1
N$47
  Bottom 0.203: U4.13 45.53,27.78 46.88,27.78 47.49,27.17 47.49,26.11 48.53,25.06 48.53,18.53 49.53,17.53 GR7.1
N$48
  Bottom 0.203: U4.12 46.03,27.28 46.76,27.28 47.08,26.97 47.08,25.95 47.29,25.75 48.03,25.02 48.03,12.78 47.9,12.13 46.27,11.12 BL7.1
N$49
  Bottom 0.203: U4.19 41.53,28.78 40.53,29.03 38.28,27.03 32.03,16.53 RE8.1
N$50
  Bottom 0.203: U4.18 42.28,29.03 40.53,29.53 37.78,27.28 34.78,24.03 GR8.1
N$51
  Bottom 0.203: U4.17 43.03,29.28 40.53,30.03 37.28,27.53 34.03,25.53 29.53,18.03 27.37,18.02 BL8.1
N$52
  Bottom 0.203: LED9.R+ RE9.2
N$53
  Bottom 0.203: GR9.2 15.38,30.01 16.6,27.58 14.77,26.15 12.94,26.56 11.93,27.58 LED9.G+
N$54
  Bottom 0.203: LED9.B+ BL9.2
N$55
  Bottom 0.203: RE10.2 LED10.R+
N$56
  Bottom 0.203: GR10.2 10.1,49.52 10.1,52.37 6.85,52.37 6.04,49.52 LED10.G+
N$57
  Bottom 0.203: LED10.B+ BL10.2
N$58
  Bottom 0.203: U5.14 29.03,43.03 30.28,40.53 28.78,38.03 27.78,37.28 26.03,36.03 24.53,33.53 17.53,29.53 18.03,28.03 RE9.1
N$59
  Bottom 0.203: U5.13 28.78,42.28 29.78,40.53 28.28,38.28 27.53,37.78 25.03,36.03 GR9.1
N$60
  Bottom 0.203: U5.12 28.53,41.53 29.03,40.78 27.78,38.53 27.28,38.28 16.53,32.03 BL9.1
N$61
  Bottom 0.203: U5.19 27.37,45.96 27.07,47.18 25.03,48.03 12.03,48.03 RE10.1
N$62
  Bottom 0.203: U5.18 27.88,45.46 27.47,47.18 27.28,47.63 25.28,48.78 22.53,48.78 21.78,49.53 GR10.1
N$63
  Bottom 0.203: U5.17 28.49,44.95 27.88,47.29 27.53,48.13 25.53,49.28 23.03,49.53 21.53,51.03 12.03,51.03 10.51,53.38 BL10.1
N$64
  Bottom 0.203: U6.14 33.78,63.53 32.03,61.78 29.28,61.78 28.03,62.28 26.53,63.03 24.03,62.53 16.78,66.53 RE11.1
N$65
  Bottom 0.203: U6.13 33.03,63.53 31.78,62.28 29.53,62.28 28.28,62.78 26.03,64.03 21.53,65.53 GR11.1
N$66
  Bottom 0.203: 28.15,63.5 17.78,69.53 17.82,72.08 BL11.1 | 28.15,63.5 28.53,63.28 | U6.12 32.28,63.53 31.53,62.78 29.53,62.78 28.15,63.5
N$67
  Bottom 0.203: U6.19 35.53,66.78 36.53,68.28 36.03,70.03 36.03,70.53 29.53,81.03 RE12.1
N$68
  Bottom 0.203: U6.18 35.53,66.03 37.03,68.28 37.03,70.28 36.53,71.53 33.53,77.53 GR12.1
N$69
  Bottom 0.203: U6.17 35.53,65.28 37.53,68.28 37.53,70.53 36.53,75.03 32.03,83.03 33.47,86.3 BL12.1
N$70
  Bottom 0.203: RE12.2 LED12.R+
N$71
  Bottom 0.203: GR12.2 29.81,83.66 32.05,85.08 31.64,85.89 30.42,87.72 27.78,87.52 LED12.G+
N$72
  Bottom 0.203: LED12.B+ BL12.2
N$73
  Bottom 0.203: RE11.2 LED11.R+
N$74
  Bottom 0.203: GR11.2 15.59,69.23 16.81,71.47 14.16,72.89 11.52,71.47 LED11.G+
N$75
  Bottom 0.203: LED11.B+ BL11.2
N$76
  Bottom 0.203: 33.29,52.28 U$3.+$1 | 33.29,52.28 32.94,53.11 | C1.1 32.24,55.73 33.19,54.78 33.19,52.39 33.29,52.28
RB7  (via drill 0.3)
  Top 0.203: v56.84,57.45 v59.48,57.45
  Bottom 0.203: U9.10 59.07,60.09 v56.84,57.45 | v59.48,57.45 65.37,64.15 SW1.2
SCL  (via drill 0.3)
  Top 0.203: v56.23,51.96 v57.45,51.96
  Bottom 0.203: U7.16 56.21,51.98 | 56.21,51.98 U9.16 | v56.23,51.96 56.21,51.98 | v57.45,51.96 58.33,51.07 U8.6 58.33,46.6 58.66,46.27 R2.1
SDA
  Bottom 0.203: 56.86,50.71 U7.15 | 56.86,50.71 57.04,50.71 57.04,48.97 U8.5 57.06,46.24 57.45,45.86 61.31,45.86 62.12,45.05 65.18,45.05 R1.1 | 56.86,50.71 U9.15
VCC  (via drill 0.3, 0.7)
  Top 0.203: 58.26,70.6 v59.07,71.26 | 72.14,52.51 v72.89,52.16 | 63.63,31.62 v63.74,30.42 | 40.81,28.47 v40.07,27.78 | 26.93,46.56 v26.18,46.94 | 35.65,67.62 v35.7,68.62 | 49.53,72.33 v49.53,72.03 | v71.26,44.03 71.47,43.63 v72.89,52.16 | 49.53,26.73 v49.53,27.03 | v50.92,60.83 v53.53,60.83 | v72.89,52.16 v72.03,49.53 | 26.73,49.53 v27.03,49.53
  Top 0.305: v26.18,46.94 26.17,47.12 | v35.7,68.62 35.45,68.33
  Top 0.406: v45.66,72.69 46.27,72.69 46.27,72.89 49.53,72.89 v49.53,72.03
  Top 2.8: 72.33,49.53 72.28,51.02 72.14,52.51 71.9,53.98 71.56,55.43 71.12,56.86 70.6,58.26 69.98,59.62 69.28,60.93 68.49,62.2 67.62,63.41 66.68,64.57 65.66,65.66 64.57,66.68 63.41,67.62 62.2,68.49 60.93,69.28 59.62,69.98 58.26,70.6 56.86,71.12 55.43,71.56 53.98,71.9 52.51,72.14 51.02,72.28 49.53,72.33 48.04,72.28 46.56,72.14 45.09,71.9 43.63,71.56 42.2,71.12 40.81,70.6 39.45,69.98 38.13,69.28 36.87,68.49 35.65,67.62 34.5,66.68 33.41,65.66 32.39,64.57 31.45,63.41 30.58,62.2 29.79,60.93 29.08,59.62 28.47,58.26 27.94,56.86 27.51,55.43 27.17,53.98 26.93,52.51 26.78,51.02 26.73,49.53 26.78,48.04 26.93,46.56 27.17,45.09 27.51,43.63 27.94,42.2 28.47,40.81 29.08,39.45 29.79,38.13 30.58,36.87 31.45,35.65 32.39,34.5 33.41,33.41 34.5,32.39 35.65,31.45 36.87,30.58 38.13,29.79 39.45,29.08 40.81,28.47 42.2,27.94 43.63,27.51 45.09,27.17 46.56,26.93 48.04,26.78 49.53,26.73 51.02,26.78 52.51,26.93 53.98,27.17 55.43,27.51 56.86,27.94 58.26,28.47 59.62,29.08 60.93,29.79 62.2,30.58 63.41,31.45 63.63,31.62 64.57,32.39 65.66,33.41 66.68,34.5 67.62,35.65 68.49,36.87 69.28,38.13 69.98,39.45 70.6,40.81 71.12,42.2 71.56,43.63 71.9,45.09 72.14,46.56 72.28,48.04 72.33,49.53
  Bottom 0.203: v59.07,71.26 U1.20 | v72.89,52.16 U2.20 | v63.74,30.42 U3.20 | v40.07,27.78 U4.20 | v26.18,46.94 U5.20 | v35.7,68.62 U6.20 | 60.9,50.74 60.87,50.71 | U7.2 63.7,50.74 | 69.43,42.14 C2.1 | v53.53,60.83 U9.1 | C3.1 v50.92,60.83
  Bottom 0.305: 60.87,50.71 U8.8 | 63.7,50.74 60.9,50.74 | 69.43,44.03 R1.2 R2.2 65.17,49.3 65.17,49.93 64.39,50.71 U7.2 | v71.26,44.03 69.43,44.03 | 69.43,44.03 69.43,42.14
  Bottom 0.406: v45.66,72.69 P1.P$2 R3.2 C3.1
(copper drawn outside any net)
  shapes: Bottom circle x3

### Text on the board
bPlace: 0 | +5 | MCLR | RetroTime | rev 2 | .com | SmallRoomLabs | PGC | PGD